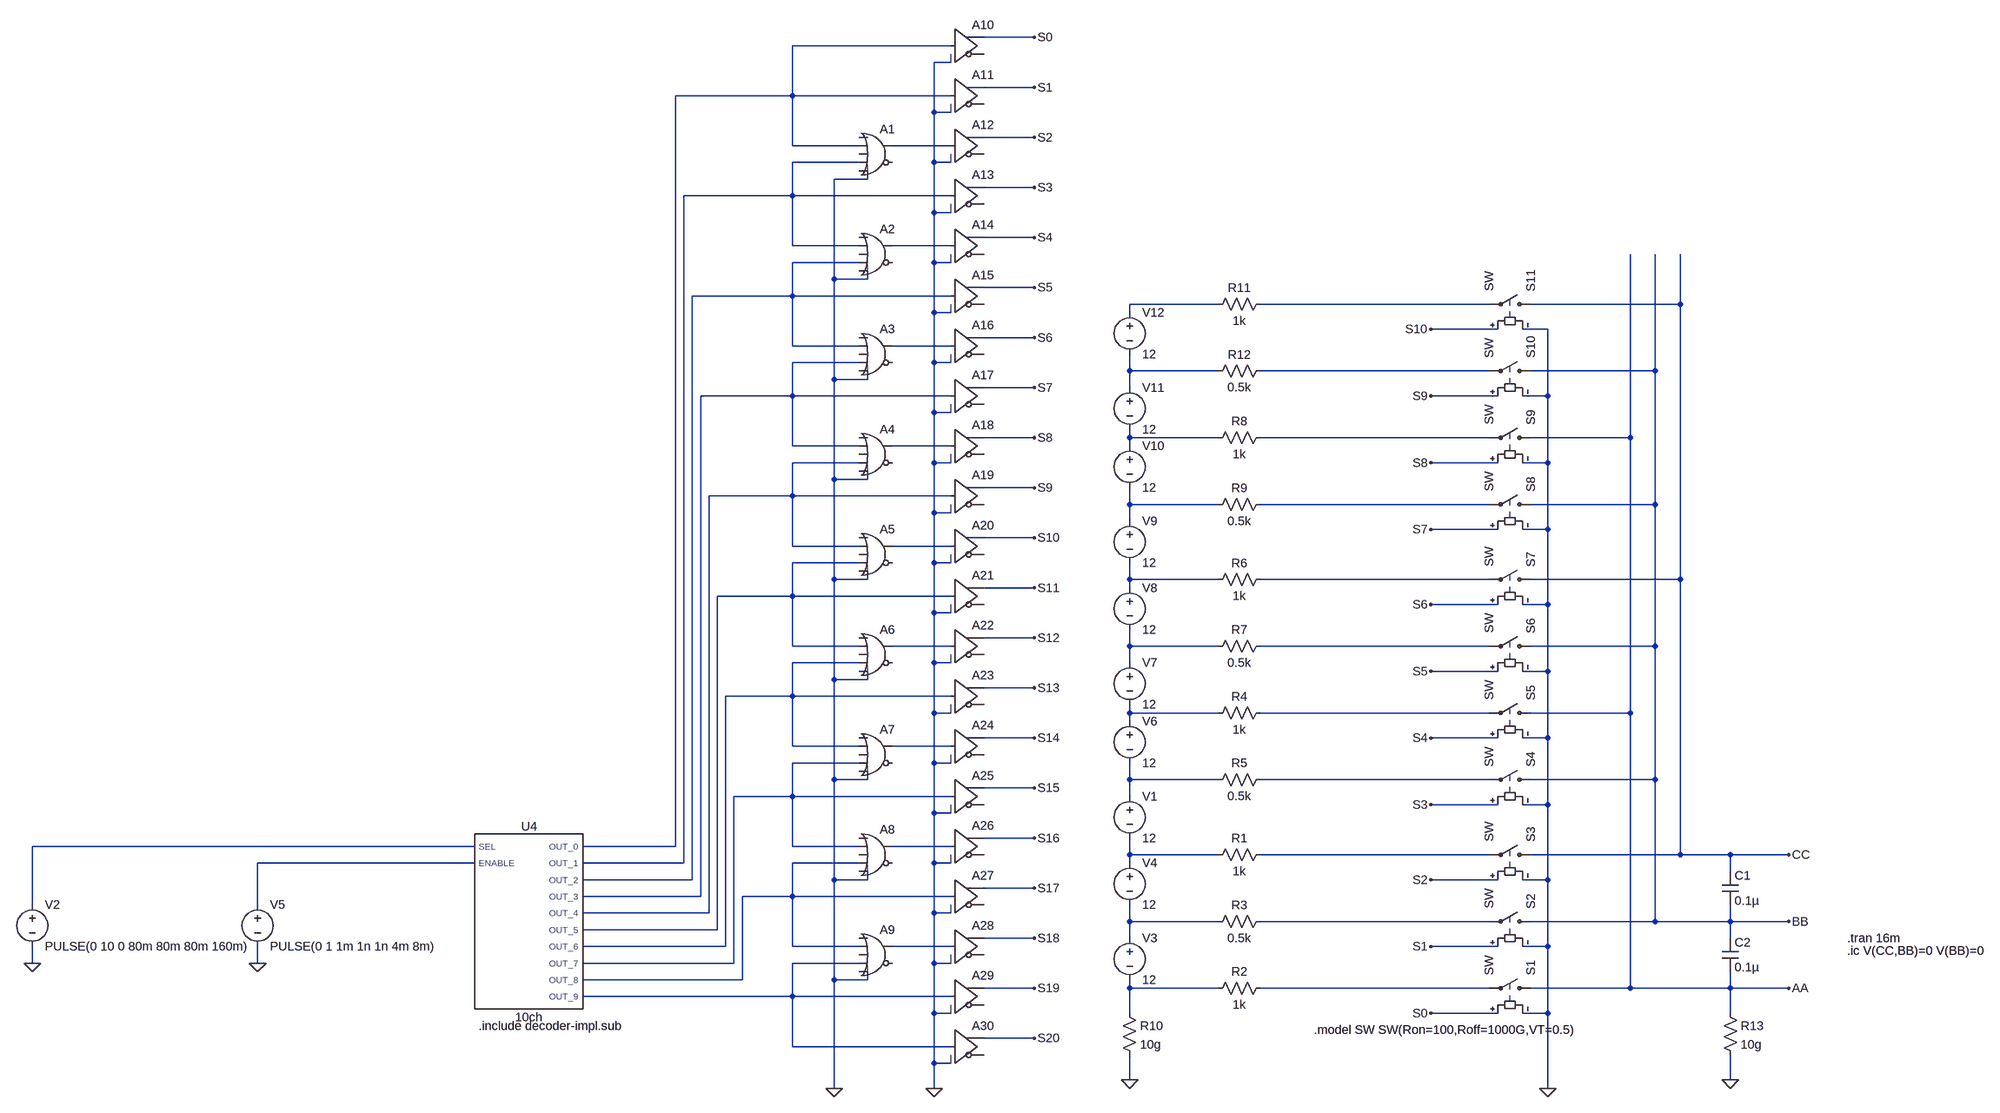
[diagram p0: schematic fc.asc]
fc.asc, the LTspice schematic file:
Version 4
SHEET 1 2604 3496
WIRE -496 672 -592 672
WIRE -656 688 -960 688
WIRE -656 720 -688 720
WIRE -496 768 -592 768
WIRE -960 784 -960 688
WIRE -960 784 -1184 784
WIRE -656 784 -960 784
WIRE -688 816 -688 720
WIRE -656 816 -688 816
WIRE -496 864 -592 864
WIRE -960 880 -960 784
WIRE -832 880 -960 880
WIRE -656 880 -768 880
WIRE -832 912 -960 912
WIRE -688 912 -688 816
WIRE -656 912 -688 912
WIRE -816 944 -816 928
WIRE -816 944 -880 944
WIRE -496 960 -592 960
WIRE -960 976 -960 912
WIRE -960 976 -1168 976
WIRE -656 976 -960 976
WIRE -688 1008 -688 912
WIRE -656 1008 -688 1008
WIRE -496 1056 -592 1056
WIRE -960 1072 -960 976
WIRE -832 1072 -960 1072
WIRE -656 1072 -768 1072
WIRE -832 1104 -960 1104
WIRE -688 1104 -688 1008
WIRE -656 1104 -688 1104
WIRE -880 1136 -880 944
WIRE -816 1136 -816 1120
WIRE -816 1136 -880 1136
WIRE -496 1152 -592 1152
WIRE -960 1168 -960 1104
WIRE -960 1168 -1152 1168
WIRE -656 1168 -960 1168
WIRE 1072 1184 880 1184
WIRE 1648 1184 1152 1184
WIRE 2016 1184 2016 1088
WIRE 2016 1184 1728 1184
WIRE -688 1200 -688 1104
WIRE -656 1200 -688 1200
WIRE 880 1200 880 1184
WIRE 1664 1232 1536 1232
WIRE 1760 1232 1712 1232
WIRE -496 1248 -592 1248
WIRE -960 1264 -960 1168
WIRE -832 1264 -960 1264
WIRE -656 1264 -768 1264
WIRE -832 1296 -960 1296
WIRE -688 1296 -688 1200
WIRE -656 1296 -688 1296
WIRE 880 1312 880 1280
WIRE 1072 1312 880 1312
WIRE 1648 1312 1152 1312
WIRE 1968 1312 1968 1088
WIRE 1968 1312 1728 1312
WIRE -880 1328 -880 1136
WIRE -816 1328 -816 1312
WIRE -816 1328 -880 1328
WIRE -496 1344 -592 1344
WIRE 880 1344 880 1312
WIRE -960 1360 -960 1296
WIRE -960 1360 -1136 1360
WIRE -656 1360 -960 1360
WIRE 1664 1360 1536 1360
WIRE 1760 1360 1760 1232
WIRE 1760 1360 1712 1360
WIRE -688 1392 -688 1296
WIRE -656 1392 -688 1392
WIRE -496 1440 -592 1440
WIRE 880 1440 880 1424
WIRE 1072 1440 880 1440
WIRE 1648 1440 1152 1440
WIRE 1920 1440 1920 1088
WIRE 1920 1440 1728 1440
WIRE -960 1456 -960 1360
WIRE -832 1456 -960 1456
WIRE -656 1456 -768 1456
WIRE 880 1456 880 1440
WIRE -832 1488 -960 1488
WIRE -688 1488 -688 1392
WIRE -656 1488 -688 1488
WIRE 1664 1488 1536 1488
WIRE 1760 1488 1760 1360
WIRE 1760 1488 1712 1488
WIRE -880 1520 -880 1328
WIRE -816 1520 -816 1504
WIRE -816 1520 -880 1520
WIRE -496 1536 -592 1536
WIRE -960 1552 -960 1488
WIRE -960 1552 -1120 1552
WIRE -656 1552 -960 1552
WIRE 880 1568 880 1536
WIRE 1072 1568 880 1568
WIRE 1648 1568 1152 1568
WIRE 1968 1568 1968 1312
WIRE 1968 1568 1728 1568
WIRE -688 1584 -688 1488
WIRE -656 1584 -688 1584
WIRE 880 1600 880 1568
WIRE 1664 1616 1536 1616
WIRE 1760 1616 1760 1488
WIRE 1760 1616 1712 1616
WIRE -496 1632 -592 1632
WIRE -960 1648 -960 1552
WIRE -832 1648 -960 1648
WIRE -656 1648 -768 1648
WIRE -832 1680 -960 1680
WIRE -688 1680 -688 1584
WIRE -656 1680 -688 1680
WIRE -880 1712 -880 1520
WIRE -816 1712 -816 1696
WIRE -816 1712 -880 1712
WIRE 880 1712 880 1680
WIRE 1072 1712 880 1712
WIRE 1648 1712 1152 1712
WIRE 2016 1712 2016 1184
WIRE 2016 1712 1728 1712
WIRE -496 1728 -592 1728
WIRE 880 1728 880 1712
WIRE -960 1744 -960 1680
WIRE -960 1744 -1104 1744
WIRE -656 1744 -960 1744
WIRE 1664 1760 1536 1760
WIRE 1760 1760 1760 1616
WIRE 1760 1760 1712 1760
WIRE -688 1776 -688 1680
WIRE -656 1776 -688 1776
WIRE -496 1824 -592 1824
WIRE -960 1840 -960 1744
WIRE -832 1840 -960 1840
WIRE -656 1840 -768 1840
WIRE 880 1840 880 1808
WIRE 1072 1840 880 1840
WIRE 1648 1840 1152 1840
WIRE 1968 1840 1968 1568
WIRE 1968 1840 1728 1840
WIRE -832 1872 -960 1872
WIRE -688 1872 -688 1776
WIRE -656 1872 -688 1872
WIRE 880 1872 880 1840
WIRE 1664 1888 1536 1888
WIRE 1760 1888 1760 1760
WIRE 1760 1888 1712 1888
WIRE -880 1904 -880 1712
WIRE -816 1904 -816 1888
WIRE -816 1904 -880 1904
WIRE -496 1920 -592 1920
WIRE -960 1936 -960 1872
WIRE -960 1936 -1088 1936
WIRE -656 1936 -960 1936
WIRE -688 1968 -688 1872
WIRE -656 1968 -688 1968
WIRE 880 1968 880 1952
WIRE 1072 1968 880 1968
WIRE 1648 1968 1152 1968
WIRE 1920 1968 1920 1440
WIRE 1920 1968 1728 1968
WIRE 880 1984 880 1968
WIRE -496 2016 -592 2016
WIRE 1664 2016 1536 2016
WIRE 1760 2016 1760 1888
WIRE 1760 2016 1712 2016
WIRE -960 2032 -960 1936
WIRE -832 2032 -960 2032
WIRE -656 2032 -768 2032
WIRE -832 2064 -960 2064
WIRE -688 2064 -688 1968
WIRE -656 2064 -688 2064
WIRE -880 2096 -880 1904
WIRE -816 2096 -816 2080
WIRE -816 2096 -880 2096
WIRE 880 2096 880 2064
WIRE 1072 2096 880 2096
WIRE 1648 2096 1152 2096
WIRE 1968 2096 1968 1840
WIRE 1968 2096 1728 2096
WIRE -496 2112 -592 2112
WIRE -960 2128 -960 2064
WIRE -960 2128 -1072 2128
WIRE -656 2128 -960 2128
WIRE 880 2128 880 2096
WIRE 1664 2144 1536 2144
WIRE 1760 2144 1760 2016
WIRE 1760 2144 1712 2144
WIRE -688 2160 -688 2064
WIRE -656 2160 -688 2160
WIRE -496 2208 -592 2208
WIRE -1696 2224 -2544 2224
WIRE -1184 2224 -1184 784
WIRE -1184 2224 -1488 2224
WIRE -960 2224 -960 2128
WIRE -832 2224 -960 2224
WIRE -656 2224 -768 2224
WIRE 880 2240 880 2208
WIRE 1072 2240 880 2240
WIRE 1648 2240 1152 2240
WIRE 2016 2240 2016 1712
WIRE 2016 2240 1728 2240
WIRE 2112 2240 2016 2240
WIRE 2224 2240 2112 2240
WIRE -1696 2256 -2112 2256
WIRE -1168 2256 -1168 976
WIRE -1168 2256 -1488 2256
WIRE -832 2256 -960 2256
WIRE -688 2256 -688 2160
WIRE -656 2256 -688 2256
WIRE 880 2256 880 2240
WIRE 2112 2272 2112 2240
WIRE -1152 2288 -1152 1168
WIRE -1152 2288 -1488 2288
WIRE -880 2288 -880 2096
WIRE -816 2288 -816 2272
WIRE -816 2288 -880 2288
WIRE 1664 2288 1536 2288
WIRE 1760 2288 1760 2144
WIRE 1760 2288 1712 2288
WIRE -496 2304 -592 2304
WIRE -1136 2320 -1136 1360
WIRE -1136 2320 -1488 2320
WIRE -960 2320 -960 2256
WIRE -960 2320 -1056 2320
WIRE -656 2320 -960 2320
WIRE -2544 2336 -2544 2224
WIRE -2112 2336 -2112 2256
WIRE -1120 2352 -1120 1552
WIRE -1120 2352 -1488 2352
WIRE -688 2352 -688 2256
WIRE -656 2352 -688 2352
WIRE 880 2368 880 2336
WIRE 1072 2368 880 2368
WIRE 1648 2368 1152 2368
WIRE 1968 2368 1968 2096
WIRE 1968 2368 1728 2368
WIRE 2112 2368 2112 2336
WIRE 2112 2368 1968 2368
WIRE 2224 2368 2112 2368
WIRE -1104 2384 -1104 1744
WIRE -1104 2384 -1488 2384
WIRE -496 2400 -592 2400
WIRE 880 2400 880 2368
WIRE 2112 2400 2112 2368
WIRE -1088 2416 -1088 1936
WIRE -1088 2416 -1488 2416
WIRE -960 2416 -960 2320
WIRE -832 2416 -960 2416
WIRE -656 2416 -768 2416
WIRE 1664 2416 1536 2416
WIRE 1760 2416 1760 2288
WIRE 1760 2416 1712 2416
WIRE -2544 2448 -2544 2416
WIRE -2112 2448 -2112 2416
WIRE -1072 2448 -1072 2128
WIRE -1072 2448 -1488 2448
WIRE -832 2448 -960 2448
WIRE -688 2448 -688 2352
WIRE -656 2448 -688 2448
WIRE -1056 2480 -1056 2320
WIRE -1056 2480 -1488 2480
WIRE -880 2480 -880 2288
WIRE -816 2480 -816 2464
WIRE -816 2480 -880 2480
WIRE -496 2496 -592 2496
WIRE 880 2496 880 2480
WIRE 1072 2496 880 2496
WIRE 1648 2496 1152 2496
WIRE 1920 2496 1920 1968
WIRE 1920 2496 1728 2496
WIRE 2112 2496 2112 2464
WIRE 2112 2496 1920 2496
WIRE 2224 2496 2112 2496
WIRE -960 2512 -960 2448
WIRE -960 2512 -1488 2512
WIRE -656 2512 -960 2512
WIRE -688 2544 -688 2448
WIRE -656 2544 -688 2544
WIRE 880 2544 880 2496
WIRE 1664 2544 1536 2544
WIRE 1760 2544 1760 2416
WIRE 1760 2544 1712 2544
WIRE 2112 2544 2112 2496
WIRE -496 2592 -592 2592
WIRE -960 2608 -960 2512
WIRE -656 2608 -960 2608
WIRE -688 2640 -688 2544
WIRE -656 2640 -688 2640
WIRE 880 2672 880 2624
WIRE 2112 2672 2112 2624
WIRE -880 2688 -880 2480
WIRE -688 2688 -688 2640
WIRE 1760 2688 1760 2544
FLAG 1760 2688 0
FLAG 2224 2240 CC
FLAG 2224 2368 BB
FLAG 2224 2496 AA
FLAG -496 672 S0
FLAG -496 768 S1
FLAG -496 864 S2
FLAG -496 960 S3
FLAG -496 1056 S4
FLAG -496 1152 S5
FLAG -496 1536 S9
FLAG -496 1632 S10
FLAG -496 1728 S11
FLAG -496 1824 S12
FLAG -496 1920 S13
FLAG -496 2016 S14
FLAG -496 2112 S15
FLAG -496 2208 S16
FLAG -496 2304 S17
FLAG -496 2400 S18
FLAG -496 2496 S19
FLAG -496 2592 S20
FLAG -880 2688 0
FLAG -688 2688 0
FLAG -2544 2448 0
FLAG -2112 2448 0
FLAG -496 1248 S6
FLAG -496 1344 S7
FLAG -496 1440 S8
FLAG 1536 2544 S0
FLAG 1536 2416 S1
FLAG 1536 2288 S2
FLAG 1536 2144 S3
FLAG 1536 2016 S4
FLAG 1536 1888 S5
FLAG 1536 1760 S6
FLAG 1536 1616 S7
FLAG 1536 1488 S8
FLAG 880 2672 0
FLAG 1536 1360 S9
FLAG 1536 1232 S10
FLAG 2112 2672 0
SYMBOL voltage 880 2384 R0
WINDOW 123 0 0 Left 0
WINDOW 39 0 0 Left 0
SYMATTR InstName V3
SYMATTR Value 12
SYMBOL voltage 880 2240 R0
WINDOW 123 0 0 Left 0
WINDOW 39 0 0 Left 0
SYMATTR InstName V4
SYMATTR Value 12
SYMBOL cap 2096 2272 R0
SYMATTR InstName C1
SYMATTR Value 0.1µ
SYMBOL cap 2096 2400 R0
SYMATTR InstName C2
SYMATTR Value 0.1µ
SYMBOL res 1168 2224 R90
WINDOW 0 0 56 VBottom 2
WINDOW 3 32 56 VTop 2
SYMATTR InstName R1
SYMATTR Value 1k
SYMBOL res 1168 2480 R90
WINDOW 0 0 56 VBottom 2
WINDOW 3 32 56 VTop 2
SYMATTR InstName R2
SYMATTR Value 1k
SYMBOL res 1168 2352 R90
WINDOW 0 0 56 VBottom 2
WINDOW 3 32 56 VTop 2
SYMATTR InstName R3
SYMATTR Value 0.5k
SYMBOL decoder-10ch -1600 2368 R0
SYMATTR InstName U4
SYMBOL Digital\\or -800 832 R0
SYMATTR InstName A1
SYMBOL voltage -2544 2320 R0
WINDOW 123 0 0 Left 0
WINDOW 39 0 0 Left 0
SYMATTR InstName V2
SYMATTR Value PULSE(0 10 0 80m 80m 80m 160m)
SYMBOL voltage -2112 2320 R0
WINDOW 123 0 0 Left 0
WINDOW 39 0 0 Left 0
SYMATTR InstName V5
SYMATTR Value PULSE(0 1 1m 1n 1n 4m 8m)
SYMBOL Digital\\or -800 1024 R0
SYMATTR InstName A2
SYMBOL Digital\\or -800 1216 R0
SYMATTR InstName A3
SYMBOL Digital\\or -800 1408 R0
SYMATTR InstName A4
SYMBOL Digital\\or -800 1600 R0
SYMATTR InstName A5
SYMBOL Digital\\or -800 1792 R0
SYMATTR InstName A6
SYMBOL Digital\\or -800 1984 R0
SYMATTR InstName A7
SYMBOL Digital\\or -800 2176 R0
SYMATTR InstName A8
SYMBOL Digital\\or -800 2368 R0
SYMATTR InstName A9
SYMBOL Digital\\buf -656 624 R0
SYMATTR InstName A10
SYMBOL Digital\\buf -656 720 R0
SYMATTR InstName A11
SYMBOL Digital\\buf -656 816 R0
SYMATTR InstName A12
SYMBOL Digital\\buf -656 912 R0
SYMATTR InstName A13
SYMBOL Digital\\buf -656 1008 R0
SYMATTR InstName A14
SYMBOL Digital\\buf -656 1104 R0
SYMATTR InstName A15
SYMBOL Digital\\buf -656 1200 R0
SYMATTR InstName A16
SYMBOL Digital\\buf -656 1296 R0
SYMATTR InstName A17
SYMBOL Digital\\buf -656 1392 R0
SYMATTR InstName A18
SYMBOL Digital\\buf -656 1488 R0
SYMATTR InstName A19
SYMBOL Digital\\buf -656 1584 R0
SYMATTR InstName A20
SYMBOL Digital\\buf -656 1680 R0
SYMATTR InstName A21
SYMBOL Digital\\buf -656 1776 R0
SYMATTR InstName A22
SYMBOL Digital\\buf -656 1872 R0
SYMATTR InstName A23
SYMBOL Digital\\buf -656 1968 R0
SYMATTR InstName A24
SYMBOL Digital\\buf -656 2064 R0
SYMATTR InstName A25
SYMBOL Digital\\buf -656 2160 R0
SYMATTR InstName A26
SYMBOL Digital\\buf -656 2256 R0
SYMATTR InstName A27
SYMBOL Digital\\buf -656 2352 R0
SYMATTR InstName A28
SYMBOL Digital\\buf -656 2448 R0
SYMATTR InstName A29
SYMBOL Digital\\buf -656 2544 R0
SYMATTR InstName A30
SYMBOL res 864 2528 R0
SYMATTR InstName R10
SYMATTR Value 10g
SYMBOL sw 1744 2496 M270
SYMATTR InstName S1
SYMBOL sw 1744 2368 M270
SYMATTR InstName S2
SYMBOL sw 1744 2240 M270
SYMATTR InstName S3
SYMBOL voltage 880 2112 R0
WINDOW 123 0 0 Left 0
WINDOW 39 0 0 Left 0
SYMATTR InstName V1
SYMATTR Value 12
SYMBOL voltage 880 1968 R0
WINDOW 123 0 0 Left 0
WINDOW 39 0 0 Left 0
SYMATTR InstName V6
SYMATTR Value 12
SYMBOL res 1168 1952 R90
WINDOW 0 0 56 VBottom 2
WINDOW 3 32 56 VTop 2
SYMATTR InstName R4
SYMATTR Value 1k
SYMBOL res 1168 2080 R90
WINDOW 0 0 56 VBottom 2
WINDOW 3 32 56 VTop 2
SYMATTR InstName R5
SYMATTR Value 0.5k
SYMBOL voltage 880 1856 R0
WINDOW 123 0 0 Left 0
WINDOW 39 0 0 Left 0
SYMATTR InstName V7
SYMATTR Value 12
SYMBOL voltage 880 1712 R0
WINDOW 123 0 0 Left 0
WINDOW 39 0 0 Left 0
SYMATTR InstName V8
SYMATTR Value 12
SYMBOL res 1168 1696 R90
WINDOW 0 0 56 VBottom 2
WINDOW 3 32 56 VTop 2
SYMATTR InstName R6
SYMATTR Value 1k
SYMBOL res 1168 1824 R90
WINDOW 0 0 56 VBottom 2
WINDOW 3 32 56 VTop 2
SYMATTR InstName R7
SYMATTR Value 0.5k
SYMBOL voltage 880 1584 R0
WINDOW 123 0 0 Left 0
WINDOW 39 0 0 Left 0
SYMATTR InstName V9
SYMATTR Value 12
SYMBOL voltage 880 1440 R0
WINDOW 123 0 0 Left 0
WINDOW 39 0 0 Left 0
SYMATTR InstName V10
SYMATTR Value 12
SYMBOL res 1168 1424 R90
WINDOW 0 0 56 VBottom 2
WINDOW 3 32 56 VTop 2
SYMATTR InstName R8
SYMATTR Value 1k
SYMBOL res 1168 1552 R90
WINDOW 0 0 56 VBottom 2
WINDOW 3 32 56 VTop 2
SYMATTR InstName R9
SYMATTR Value 0.5k
SYMBOL sw 1744 2096 M270
SYMATTR InstName S4
SYMBOL sw 1744 1968 M270
SYMATTR InstName S5
SYMBOL sw 1744 1840 M270
SYMATTR InstName S6
SYMBOL sw 1744 1712 M270
SYMATTR InstName S7
SYMBOL sw 1744 1568 M270
SYMATTR InstName S8
SYMBOL sw 1744 1440 M270
SYMATTR InstName S9
SYMBOL sw 1744 1312 M270
SYMATTR InstName S10
SYMBOL voltage 880 1328 R0
WINDOW 123 0 0 Left 0
WINDOW 39 0 0 Left 0
SYMATTR InstName V11
SYMATTR Value 12
SYMBOL voltage 880 1184 R0
WINDOW 123 0 0 Left 0
WINDOW 39 0 0 Left 0
SYMATTR InstName V12
SYMATTR Value 12
SYMBOL res 1168 1168 R90
WINDOW 0 0 56 VBottom 2
WINDOW 3 32 56 VTop 2
SYMATTR InstName R11
SYMATTR Value 1k
SYMBOL res 1168 1296 R90
WINDOW 0 0 56 VBottom 2
WINDOW 3 32 56 VTop 2
SYMATTR InstName R12
SYMATTR Value 0.5k
SYMBOL sw 1744 1184 M270
SYMATTR InstName S11
SYMBOL res 2096 2528 R0
SYMATTR InstName R13
SYMATTR Value 10g
TEXT 2336 2400 Left 2 !.tran 16m
TEXT 2336 2424 Left 2 !.ic V(CC,BB)=0 V(BB)=0
TEXT -1688 2568 Left 2 !.include decoder-impl.sub
TEXT 1312 2576 Left 2 !.model SW SW(Ron=100,Roff=1000G,VT=0.5)

The netlist it stands for:
* fc.asc
V3 N038 N042 12
V4 N034 N038 12
C1 CC BB 0.1µ
C2 BB AA 0.1µ
R1 N035 N034 1k
R2 N043 N042 1k
R3 N039 N038 0.5k
XU4 N032 N036 N001 N003 N005 N009 N015 N019 N025 N029 N037 N041 decoder-10ch  ; pins SEL ENABLE OUT_0 OUT_1 OUT_2 OUT_3 OUT_4 OUT_5 OUT_6 OUT_7 OUT_8 OUT_9
A1 0 N001 0 N003 0 0 N002 0 OR
V2 N032 0 PULSE(0 10 0 80m 80m 80m 160m)
V5 N036 0 PULSE(0 1 1m 1n 1n 4m 8m)
A2 0 N003 0 N005 0 0 N004 0 OR
A3 0 N005 0 N009 0 0 N008 0 OR
A4 0 N009 0 N015 0 0 N014 0 OR
A5 0 N015 0 N019 0 0 N018 0 OR
A6 0 N019 0 N025 0 0 N022 0 OR
A7 0 N025 0 N029 0 0 N028 0 OR
A8 0 N029 0 N037 0 0 N033 0 OR
A9 0 N037 0 N041 0 0 N040 0 OR
A10 N001 0 0 0 0 0 S0 0 BUF
A11 N001 0 0 0 0 0 S1 0 BUF
A12 N002 0 0 0 0 0 S2 0 BUF
A13 N003 0 0 0 0 0 S3 0 BUF
A14 N004 0 0 0 0 0 S4 0 BUF
A15 N005 0 0 0 0 0 S5 0 BUF
A16 N008 0 0 0 0 0 S6 0 BUF
A17 N009 0 0 0 0 0 S7 0 BUF
A18 N014 0 0 0 0 0 S8 0 BUF
A19 N015 0 0 0 0 0 S9 0 BUF
A20 N018 0 0 0 0 0 S10 0 BUF
A21 N019 0 0 0 0 0 S11 0 BUF
A22 N022 0 0 0 0 0 S12 0 BUF
A23 N025 0 0 0 0 0 S13 0 BUF
A24 N028 0 0 0 0 0 S14 0 BUF
A25 N029 0 0 0 0 0 S15 0 BUF
A26 N033 0 0 0 0 0 S16 0 BUF
A27 N037 0 0 0 0 0 S17 0 BUF
A28 N040 0 0 0 0 0 S18 0 BUF
A29 N041 0 0 0 0 0 S19 0 BUF
A30 N041 0 0 0 0 0 S20 0 BUF
R10 N042 0 10g
S1 AA N043 S0 0 SW
S2 BB N039 S1 0 SW
S3 CC N035 S2 0 SW
V1 N030 N034 12
V6 N026 N030 12
R4 N027 N026 1k
R5 N031 N030 0.5k
V7 N023 N026 12
V8 N020 N023 12
R6 N021 N020 1k
R7 N024 N023 0.5k
V9 N016 N020 12
V10 N012 N016 12
R8 N013 N012 1k
R9 N017 N016 0.5k
S4 BB N031 S3 0 SW
S5 AA N027 S4 0 SW
S6 BB N024 S5 0 SW
S7 CC N021 S6 0 SW
S8 BB N017 S7 0 SW
S9 AA N013 S8 0 SW
S10 BB N011 S9 0 SW
V11 N010 N012 12
V12 N006 N010 12
R11 N007 N006 1k
R12 N011 N010 0.5k
S11 CC N007 S10 0 SW
R13 AA 0 10g
.tran 16m
.ic V(CC,BB)=0 V(BB)=0
.include decoder-impl.sub
.model SW SW(Ron=100,Roff=1000G,VT=0.5)
.lib decoder-impl.sub
.backanno
.end